# Altium schematic sheet SD_Card.SchDoc
size A4; SheetNumber: 5; SheetTotal: 8
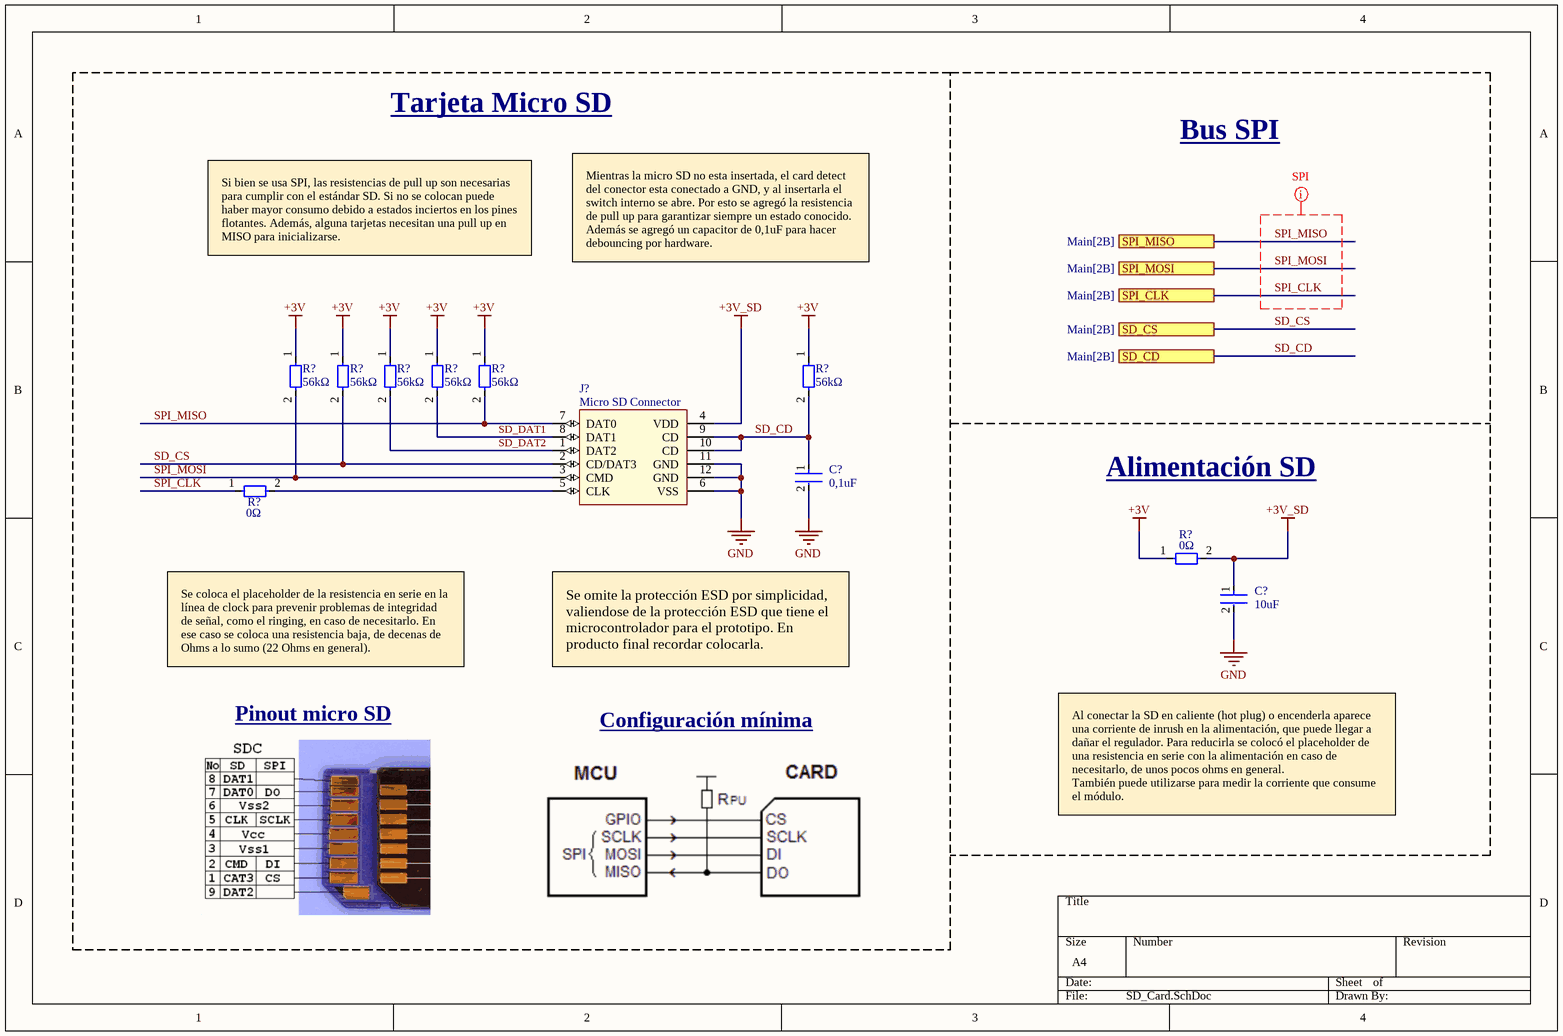
[diagram p0: SD_Card.SchDoc]

## Parts
(Parts that share a designator on the sheet are numbered #1, #2 ... from top to bottom, then left to right.)
C?#1  Capacitance: 0,1uF  [FP-CL21-IPC_B]  (hidden comment: CL21A106KPFNNNE)
C?#2  Capacitance: 10uF  [FP-CL21-IPC_B]  (hidden comment: CL21A106KPFNNNE)
J?  Micro SD Connector  [MEM2061-01-188-00-A_revA]
R?#1  value 56kΩ  [PACKAGE_0805]  (hidden comment: Simbolo de resistencia genérica)
R?#2  value 56kΩ  [PACKAGE_0805]  (hidden comment: Simbolo de resistencia genérica)
R?#3  value 56kΩ  [PACKAGE_0805]  (hidden comment: Simbolo de resistencia genérica)
R?#4  value 56kΩ  [PACKAGE_0805]  (hidden comment: Simbolo de resistencia genérica)
R?#5  value 56kΩ  [PACKAGE_0805]  (hidden comment: Simbolo de resistencia genérica)
R?#6  value 56kΩ  [PACKAGE_0805]  (hidden comment: Simbolo de resistencia genérica)
R?#7  value 0Ω  [PACKAGE_0805]  (hidden comment: Simbolo de resistencia genérica)
R?#8  value 0Ω  [PACKAGE_0805]  (hidden comment: Simbolo de resistencia genérica)

## Blocks framed on the sheet
Tarjeta Micro SD: C?#1 J? R?#1-R?#7

## Ports
SD_CD (see Main[2B]), SD_CS (see Main[2B]), SPI_CLK (see Main[2B]), SPI_MISO (see Main[2B]), SPI_MOSI (see Main[2B])

## Nets
+3V: R?#1.1 R?#2.1 R?#3.1 R?#4.1 R?#5.1 R?#6.1 R?#8.1
+3V_SD: C?#2.1 J?.4(VDD) R?#8.2
GND: C?#1.2 C?#2.2 J?.6(VSS) J?.11(GND) J?.12(GND)
SD_CD: C?#1.1 J?.9(CD) J?.10(CD) R?#6.2 ; port SD_CD
SD_CS: J?.2(CD/DAT3) R?#2.2 ; port SD_CS
SD_DAT1: J?.8(DAT1) R?#4.2
SD_DAT2: J?.1(DAT2) R?#3.2
SPI_CLK: R?#7.1 ; port SPI_CLK
SPI_MISO: J?.7(DAT0) R?#5.2 ; port SPI_MISO
SPI_MOSI: J?.3(CMD) R?#1.2 ; port SPI_MOSI
NetJ?_5: J?.5(CLK) R?#7.2

## Layout directives
net class SPI: SPI_CLK, SPI_MISO, SPI_MOSI

## Notes on the sheet
- Bus SPI
- Si bien se usa SPI, las resistencias de pull up son necesarias para cumplir con el estándar SD. Si no se colocan puede haber mayor consumo debido a estados inciertos en los pines flotantes. Además, alguna tarjetas necesitan una pull up en MISO para inicializarse.
- Mientras la micro SD no esta insertada, el card detect del conector esta conectado a GND, y al insertarla el switch interno se abre. Por esto se agregó la resistencia de pull up para garantizar siempre un estado conocido. Además se agregó un capacitor de 0,1uF para hacer debouncing por hardware.
- Alimentación SD
- Se coloca el placeholder de la resistencia en serie en la línea de clock para prevenir problemas de integridad de señal, como el ringing, en caso de necesitarlo. En ese caso se coloca una resistencia baja, de decenas de Ohms a lo sumo (22 Ohms en general).
- Se omite la protección ESD por simplicidad, valiendose de la protección ESD que tiene el microcontrolador para el prototipo. En producto final recordar colocarla.
- Pinout micro SD
- Configuración mínima
- Al conectar la SD en caliente (hot plug) o encenderla aparece una corriente de inrush en la alimentación, que puede llegar a dañar el regulador. Para reducirla se colocó el placeholder de una resistencia en serie con la alimentación en caso de necesitarlo, de unos pocos ohms en general.
  También puede utilizarse para medir la corriente que consume el módulo.

## Library data of the parts
C?#1 C?#2 = CMP-2000-06103-2: CL21 Series 0805 10uF 10V ±10% Tolerance X5R Multilayer Ceramic Chip Capacitor; Case Code (Imperial): 0805; Mount: Surface Mount; Depth: 1.25mm; Length: 2mm; Lead Free: Lead Free; Packaging: Tape and Reel; Dielectric: X5R; Width: 0.049inch; Package Quantity: 1; Height: 1.25mm; Case/Package: 0805; Voltage Rating: 10V; Thickness: 0.053inch; Max Operating Temperature: 85°C; Tolerance: 10%; Case Code (Metric): 2012; Contact Plating: Tin; Min Operating Temperature: -55°C; Radiation Hardening: No; Voltage Rating (DC): 10V
J? = MEM2061-01-188-00-A_revA: Micro SD Memory Card Connector, 1.88mm Profile SMT,Push Push, with normally closed switch. MEM2061-01-188-00-A_revA
R?#1-R?#8 = Generic R